# EAGLE design eFingernailAllComponents (EAGLE 7.4.0)
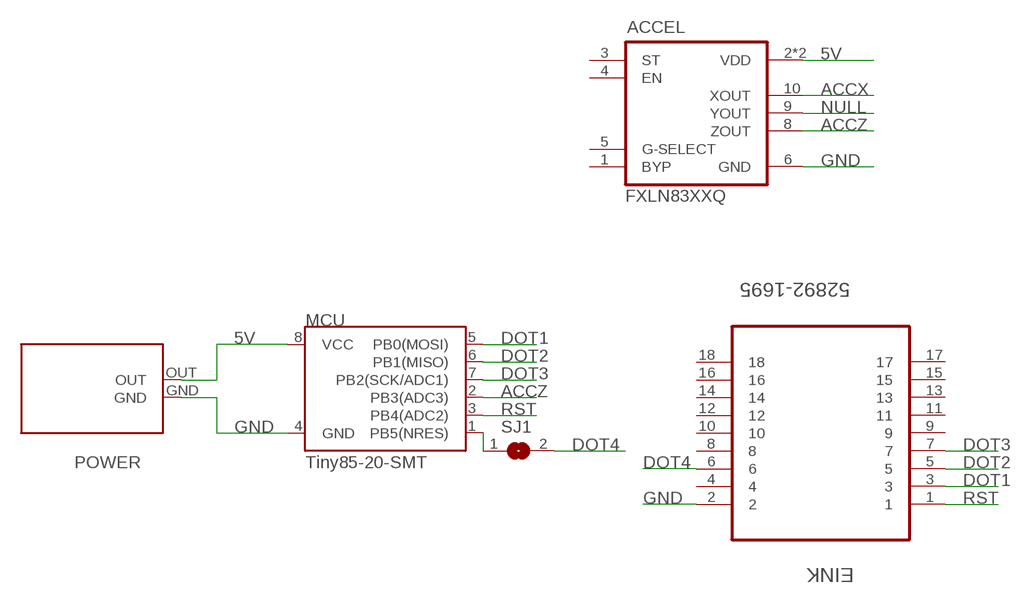
[diagram p0: schematic, sheet 1]

## Parts
ACCEL  FXLN83XXQ  [QFN12-3X3]
EINK  52892-1695  [MOLEX_52892-1695]
MCU  Tiny85-20-SMT  ATTINY45TINY85-20-SMT  [SO08-EIAJ]
POWER  P9027LP-R  [P9027LP-R]
SJ1  SOLDERJUMPER  [SOLDERJUMPER_ARROW_NOPASTE]

## Nets
5V: ACCEL.2(VDD) ACCEL.7(VDD) MCU.8(VCC) POWER.OUT
ACCX: ACCEL.10(XOUT)
ACCZ: ACCEL.8(ZOUT) MCU.2(PB3(ADC3))
DOT1: EINK.3 MCU.5(PB0(MOSI))
DOT2: EINK.5 MCU.6(PB1(MISO))
DOT3: EINK.7 MCU.7(PB2(SCK/ADC1))
DOT4: EINK.6 SJ1.2
GND: ACCEL.6(GND) EINK.2 MCU.4(GND) POWER.GND
N$1: MCU.1(PB5(NRES)) SJ1.1
NULL: ACCEL.9(YOUT)
RST: EINK.1 MCU.3(PB4(ADC2))
Unconnected: ACCEL.1(BYP) ACCEL.3(ST) ACCEL.4(EN) ACCEL.5(G-SELECT) EINK.4 EINK.8 EINK.9 EINK.10 EINK.11 EINK.12 EINK.13 EINK.14 EINK.15 EINK.16 EINK.17 EINK.18

## Library data of the parts
ACCEL = freescale-fxln83xxq:FXLN83XXQ: Features • Supply voltage (V DD ) from 1.71 V to 3.6 V • Accelerometer operating ranges selectable • ±2 gor ±8 g(FXLN83x1Q) • ±4 gor ±16 g(FXLN83x2Q) • Low current consumption of 180 μA (typical) The library has been designed by Richard Magdycz <https://www.facebook.com/groups/eaglecadsoftUK>
EINK = Molex_By_element14_Batch_1:52892-1695: CONNECTOR, FPC, ZIF, 0.50MM, 16 WAY; MPN: 52892-1695; OC_FARNELL: 1556807; OC_NEWARK: 92M6601; PACKAGE: CONNECTOR, FPC, ZIF, 0.50MM, 16 WAY; SUPPLIER: Molex
MCU = SparkFun-DigitalIC:ATTINY45: Atmel 8-pin 2/4/8kB flash uC; PROD_ID: IC-09092
POWER = PowerReceiver:P9027LP-R
SJ1 = microbuilder:SOLDERJUMPER: SMD Solder JUMPER Solder the two pads together to create a connection, or remove the solder to break it. REFLOW - Use this footprint for solder paste and reflow ovens. WAVE - Use this footprint for hand-soldering (larger pads). CLOSED - Has a trace between the two pads to ensure it is closed by default. The trace needs to be cut to disable the jumper, and can be closed again by creating a solder bridge between the two pads.; BOM: EXCLUDE

## Board
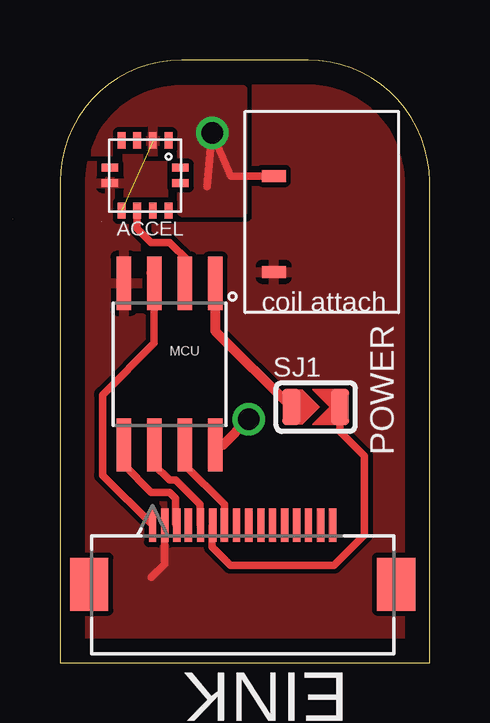
[diagram p1: board, top side]
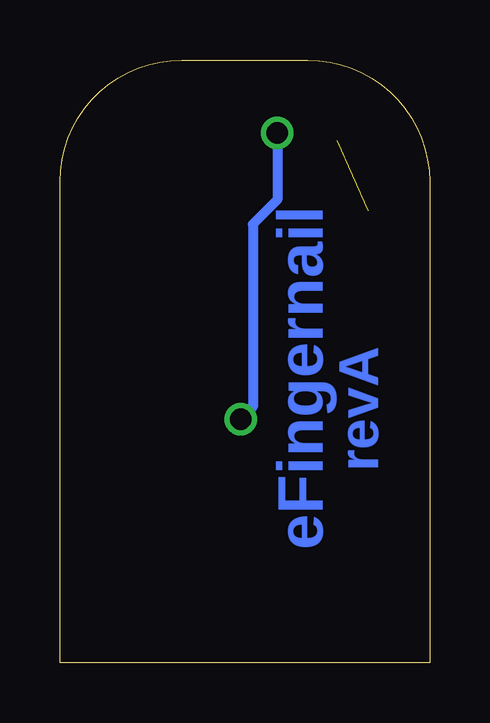
[diagram p2: board, bottom side, seen from below]

Size 15.42 x 25.14 mm. Coordinates in mm from the lower left corner, seen from the top.
Outline: 0,0 15.42,0 15.42,20.06 arc90 10.34,25.14 5.08,25.14 arc90 0,20.06 0,0
Copper layers (1*16): Top 0.035mm / dielectric 1.5mm / Bottom 0.035mm
Design rules "default": minimum track width 10mil, minimum drill 24mil, track to track 8mil, track to pad 8mil, pad to pad 8mil, via to via 8mil, smd to smd 8mil, copper to edge 40mil, drill to drill 8mil, minimum pad ring 10mil, minimum via ring 8mil, stop-mask expansion 4mil, vias tented up to drill 0mil, thermal gap 10mil

### Footprints (pad centres in the part's own frame; a part is rotated, then mirrored left to right if it is on the bottom)
QFN12-3X3 = smd 0.33 x 0.686: 1 -0.975,-1.46; 2 -0.32,-1.46; 3 0.33,-1.46; 4 0.975,-1.46; 7 0.975,1.465; 8 0.33,1.465; 9 -0.32,1.465; 10 -0.975,1.465 | smd 0.686 x 0.33: 5 1.47,-0.325; 6 1.47,0.32; 11 -1.47,0.325; 12 -1.47,-0.32
MOLEX_52892-1695 = smd 0.305 x 1.397: 1 3.759,2.896; 2 3.251,2.896; 3 2.743,2.896; 4 2.261,2.896; 5 1.753,2.896; 6 1.245,2.896; 7 0.762,2.896; 8 0.254,2.896; 9 -0.254,2.896; 10 -0.762,2.896; 11 -1.245,2.896; 12 -1.753,2.896; 13 -2.261,2.896; 14 -2.743,2.896; 15 -3.251,2.896; 16 -3.759,2.896 | smd 1.6 x 2.21: 17 -6.401,5.359; 18 6.401,5.359
SO08-EIAJ = smd 0.61 x 2.21: 1 -1.905,-3.378; 2 -0.635,-3.378; 3 0.635,-3.378; 4 1.905,-3.378; 5 1.905,3.353; 6 0.635,3.353; 7 -0.635,3.353; 8 -1.905,3.353
P9027LP-R = smd 1 x 0.5: GND 2,2.5; OUT 2,-1.5
SOLDERJUMPER_ARROW_NOPASTE = smd 0.762 x 1.524: 1 -1.016,0; 2 1.016,0

### Placement (x,y rotation side)
ACCEL  3.56,20.32 180 top
EINK  7.62,8.64 180 top
MCU  4.57,12.45 180 top
POWER  10.92,18.8 180 top
SJ1  10.67,10.67 0 top

### Tracks (layer width: path | path; a pad name or v marks a point on that pad's centre or on a via)
5V  (via drill 0.9)  (1 unrouted)
  Top 0.305: POWER.OUT 7.14,20.3 7.11,20.32 v6.35,22.1 6.14,19.85
  Top 0.406: MCU.8 6.81,9.09 v7.87,10.16
  Bottom 0.406: v6.35,22.1 6.35,19.3 7.37,18.29 7.37,10.67 v7.87,10.16
  pour Top: 5.08,18.8 7.62,18.8 7.62,23.88 1.27,23.88 1.27,21.34 5.08,21.34
ACCZ
  Top 0.305: MCU.2 5.33,15.95 5.33,16.76 4.57,17.53 3.81,17.53 3.23,18.11 ACCEL.8
DOT1
  Top 0.305: MCU.5 2.67,8.26 3.81,7.11 4.57,7.11 4.83,6.86 4.83,5.79 EINK.3
DOT2
  Top 0.305: MCU.6 3.94,8.26 4.57,7.62 4.83,7.62 5.84,6.6 5.84,5.77 EINK.5
DOT3
  Top 0.305: MCU.7 5.21,8.26 6.86,6.6 EINK.7
DOT4
  Top 0.305: SJ1.2 11.68,9.65 12.7,8.64 12.7,5.33 11.43,4.06 7.11,4.06 6.35,4.83 6.35,5.71 EINK.6
GND
  Top 0.305: EINK.2 4.37,4.12 3.81,3.56
  pour Top (rank 3): -10.16,31.5 30.48,31.5 30.48,-9.14 -10.16,-9.14
N$1
  Top 0.406: MCU.1 6.48,13.84 SJ1.1
RST
  Top 0.305: 3.81,15.7 MCU.3 3.94,13.34 1.78,11.18 1.78,7.82 EINK.1 | 3.81,16.76 3.81,16.26
  Top 0.406: MCU.3 3.94,15.95 arc45 3.81,16.26

### Text on the board
Bottom: eFingernail | revA